# Altium project Common_AMC_Box.PrjPcb (part 5 of 6)

## Sheet USB_UART.SchDoc: Title
size 420 x 297 mm; Author: G.Kasprowicz; CompanyName: WUT ISE; DrawnBy: G.Kasprowicz; Organization: WUT ISE; Address1: PW ISE; Address2: Nowowiejska 15/19 00-665 Warsaw; Address3: gkasprow@gmail.com; DocumentNumber: 15; Revision: 2; SheetNumber: 15; SheetTotal: 18; ModifiedBy: -; CheckedDate: -; Title2: Title 2; DivGrp: WUT ISE; Designer: G.Kasprowicz; ModifiedDate: -; ProjectName: Sensor Box
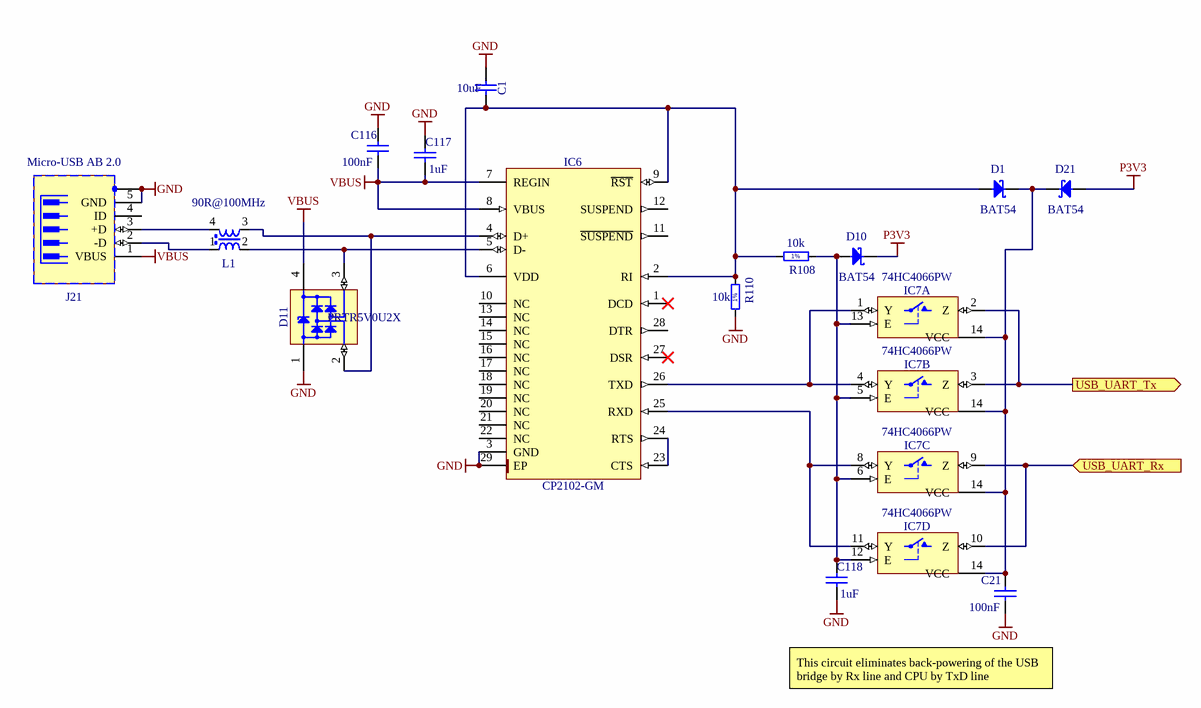
[diagram p13: USB_UART.SchDoc]

### Parts
C1  10uF  [CAPC2012X135N]
C21  100nF  [CAPC1005X55N]
C116  100nF  [CAPC1005X55N]
C117  1uF  [CAPC1005X55N]
C118  1uF  [CAPC1005X55N]
D1  BAT54  [SOT95P240X130-3N]
D10  BAT54  [SOT95P240X130-3N]
D11  PRTR5V0U2X  [SOT190P230X110-4N]
D21  BAT54  [SOT95P240X130-3N]
IC6  CP2102-GM  [QFN50P500X500X100-29N-S335]
IC7  74HC4066PW  [SOP65P640X110-14N]  (parts A,B,C,D of 4)
J21  Micro-USB AB 2.0  [HIROSE_ZX62RD-AB-5P8(30)]
L1  90R@100MHz  [IND_MURATA_DLW21S]
R108  10k  [RESC1005X40N]
R110  10k  [RESC1005X40N]

### Ports
USB_UART_Rx (in), USB_UART_Tx (out)

### Nets
GND: C1.1 C21.1 C116.2 C117.1 C118.2 D11.1(GND) IC6.3(GND) IC6.29(EP) IC7.7(GND) J21.5(GND) J21.6(SH) R110.1
P3V3: D10.3(C) D21.1(A)
VBUS: C116.1 C117.2 D11.4(VCC) IC6.7(REGIN) IC6.8(VBUS) J21.1(VBUS)
NetC1_2: C1.2 D1.1(A) IC6.2(RI) IC6.6(VDD) IC6.9(~{RST}) R108.1 R110.2
NetC21_2: C21.2 D1.3(C) D21.3(C) IC7.14(VCC)
NetC118_1: C118.1 D10.1(A) IC7.5(E) IC7.6(E) IC7.12(E) IC7.13(E) R108.2
NetD11_2: D11.2(I/O1) IC6.4(D+) L1.3
NetD11_3: D11.3(I/O2) IC6.5(D-) L1.2
NetIC6_23: IC6.23(CTS) IC6.24(RTS)
NetIC6_25: IC6.25(RXD) IC7.8(Y) IC7.11(Y)
NetIC6_26: IC6.26(TXD) IC7.1(Y) IC7.4(Y)
NetIC7_2: IC7.2(Z) IC7.3(Z) ; port USB_UART_Tx
NetIC7_9: IC7.9(Z) IC7.10(Z) ; port USB_UART_Rx
NetJ21_2: J21.2(-D) L1.1
NetJ21_3: J21.3(+D) L1.4

Not connected (* = marked no-connect by the designer): IC6 1(DCD)* 10(NC) 11(~{SUSPEND}) 12(SUSPEND) 13(NC) 14(NC) 15(NC) 16(NC) 17(NC) 18(NC) 19(NC) 20(NC) 21(NC) 22(NC) 27(DSR)* 28(DTR); J21 4(ID)

### Notes on the sheet
- This circuit eliminates back-powering of the USB bridge by Rx line and CPU by TxD line
- Project/Equipment
- Document
- Designer
- Drawn by
- Check.by
- Copyright WUT ISE 2020.
  This documentation describes Open Hardware and is licensed under the CERN OHL v.1.2. You may redistribute and modify this documentation under the terms of the CERN OHL v.1.2. (http://ohwr.org/CERNOHL). This documentation is distributed WITHOUT ANY EXPRESS OR IMPLIED WARRANTY, INCLUDING OF MERCHANTABILITY, SATISFACTORY QUALITY AND FITNESS FOR A PARTICULAR PURPOSE. Please see the CERN OHL v.1.2 for applicable conditions.
- Contact
- File
- Last Mod.
- Print Date
- Sheet
- Size
- A3
- of
- Rev
- (in symbol R0402_10K_1%_0.0625W_100PPM) 1%

### Library data of the parts
C1 = CC0805_10UF_16V_10%_X5R: Non-polarised capacitor; Part Description: SMD Multilayer Chip Ceramic Capacitor; Manufacturer: GENERIC; Manufacturer1 Part Number: C0805C106K4PAC; Voltage: 16V; TC: X5R; Tolerance: ±10%; Part Number: CC0805_10UF_16V_10%_X5R; Component Kind: Standard; Component Type: Standard; Pin Count: 2; Value: 10uF; Status: Preferred; Manufacturer Part Number: CC0805_10UF_16V_10%_X5R; Case: 0805; Mounted: Yes; Socket: No; SMD: Yes; Manufacturer1 Example: KEMET; Manufacturer1 ComponentHeight: 1.4mm; HelpURL: \\cern.ch\dfs\Applications\Altium\Datasheets\CC1206_X5R_KEMET.pdf; Author: CERN DEM JLC; CreateDate: 03.12.2007; LatestRevisionDate: 03.12.2007; Sense: No
C21 C116 = CC0402_100NF_16V_10%_X5R: as C113 on sheet Thermal_MGT; Part Number: CC0402_100NF_16V_10%_X5R; Component Kind: Standard; Component Type: Standard; Pin Count: 2; Value: 100nF; Status: None; Manufacturer Part Number: CC0402_100NF_16V_10%_X5R; Case: 0402; Mounted: Yes; Socket: No; SMD: Yes; Manufacturer1 Example: MURATA; Manufacturer1 ComponentHeight: 0.55mm; HelpURL: \\cern.ch\dfs\Applications\Altium\Datasheets\CC0402_X5R_MURATA_GRM.pdf; Author: CERN DEM JLC; CreateDate: 10.12.2013; LatestRevisionDate: 10.12.2013; Sense: No
C117 C118 = CC0402_1UF_16V_10%_X5R: as C55 on sheet USB_Hub_AMCbox; Part Number: CC0402_1UF_16V_10%_X5R; Component Kind: Standard; Component Type: Standard; Pin Count: 2; Value: 1uF; Status: Preferred; Manufacturer Part Number: CC0402_1UF_16V_10%_X5R; Case: 0402; Mounted: Yes; Socket: No; SMD: Yes; Sense: No; Manufacturer1 Example: TDK; Manufacturer1 ComponentHeight: 0.55mm; HelpURL: \\cern.ch\dfs\Applications\Altium\Datasheets\CC0402_X5R_TDK_C.pdf; Author: CERN DEM JLC; CreateDate: 25.10.2012; LatestRevisionDate: 25.10.2012
D1 D10 D21 = BAT54: as D5 on sheet CPU_ETH; Part Number: BAT54; Component Kind: Standard; Component Type: Standard; Device: BAT54; PackageDescription: SOT23 3-Leads, Pitch 0.95mm - Body 1.3x2.9mm, IPC Medium Density; Manufacturer Part Number: BAT54; Pin Count: 3; Case: SOT23-3; Mounted: Yes; Socket: No; SMD: Yes; ComponentHeight: 1.30mm; HelpURL: \\cern.ch\dfs\Applications\Altium\Datasheets\BAT54.pdf; Author: CERN DEM JLC; CreateDate: 2009-09-17; LatestRevisionDate: 2010-05-27
D11 = PRTR5V0U2X: Ultra Low Capacitance Double Rail-to-Rail ESD Protection Diode; Part Description: Ultra Low Capacitance (1pF) Double Rail-to-Rail ESD Protection Diode (8kV); Manufacturer: NXP SEMICONDUCTORS; Voltage: 5.5V; PressFit: No; Bonding: No; Table: Diodes; Part Number: PRTR5V0U2X; Component Kind: Standard; Component Type: Standard; Device: PRTR5V0U2X; PackageDescription: SOT143B, SOT, 1.90mm Pitch; 4 Pin, 1.30mm W X 2.90mm L X 1.10mm H body, IPC Medium Density; Manufacturer Part Number: PRTR5V0U2X; Pin Count: 4; Case: SOT143B; Mounted: Yes; Socket: No; SMD: Yes; ComponentHeight: 1.1mm; HelpURL: \\cern.ch\dfs\Applications\Altium\Datasheets\PRTR5V0U2X.pdf; Author: CERN DEM JLC; CreateDate: 2011-03-22; LatestRevisionDate: 2011-03-22
IC6 = CP2102-GM: Single-Chip USB to UART Bridge; Manufacturer: SILICON LABS; Table: Analog & Interface; Part Number: CP2102-GM; Component Kind: Standard; Component Type: Standard; Device: CP2102-GM; PackageDescription: QFN, 0.50mm Pitch, Square; 28 pin, 5.00mm L X 5.00mm W X 1.00mm H body (w/thermal tab 3.35 X 3.35mm),  IPC Medium Density; Part Description: Single-Chip USB to UART Bridge; Manufacturer Part Number: CP2102-GM; Pin Count: 29; Case: QFN28; Mounted: Yes; Socket: No; SMD: Yes; ComponentHeight: 1.0mm; Author: CERN DEM JLC; HelpURL: \\cern.ch\dfs\Applications\Altium\Datasheets\CP2102-GM.pdf; CreateDate: 2011-03-03; LatestRevisionDate: 2011-03-03
IC7 = 74HC4066PW: Part Description: Quad Single-Pole Single-Throw Analog Switch; Manufacturer: NXP SEMICONDUCTORS; PressFit: No; Bonding: No; Part Number: 74HC4066PW; Component Kind: Standard; Component Type: Standard; Device: 74HC4066PW; PackageDescription: SOP, 0.65mm Pitch; 14 Pin, 4.40mm W X 5.00mm L X 1.20mm H body, IPC Medium Density; Manufacturer Part Number: 74HC4066PW; Pin Count: 14; Case: TSSOP14; Mounted: Yes; Socket: No; SMD: Yes; Sense: No; ComponentHeight: 1.1mm; Author: CERN DEM JLC; HelpURL: \\cern.ch\dfs\Applications\Altium\Datasheets\74HC4066PW.pdf; CreateDate: 19.11.2014; LatestRevisionDate: 19.11.2014
J21 = HIROSE_ZX62RD-AB-5P8(30): 5 Pin + 1 Shield USB Receptacle; Part Description: Micro-USB 2.0 Right Angle, SMD Type AB - Reverse (Top mount), Shell Through Hole; Manufacturer: HIROSE (HRS); PressFit: No; Part Number: HIROSE_ZX62RD-AB-5P8(30); Component Kind: Standard; Component Type: Standard; Pin Count: 7; Family: Micro-USB AB 2.0; Mounted: Yes; Socket: No; SMD: Yes; Sense: No; Status: None; Manufacturer Part Number: ZX62RD-AB-5P8(30); ComponentHeight: 2.35mm; HelpURL: \\cern.ch\dfs\Applications\Altium\Datasheets\HIROSE_ZX62RD-AB-5P8(30).pdf; ComponentLink1URL: \\cern.ch\dfs\Applications\Altium\Datasheets\HIROSE_ZX62RD-AB-5P8(30)_Package-Drawing.pdf; ComponentLink1Description: Package-Drawing; Author: CERN DEM JMW; CreateDate: 22.06.2017; LatestRevisionDate: 22.06.2017
L1 = IND_MURATA_DLW21SN900SQ2L: Inductor Common Mode; Part Description: Wire Wound Common Mode Choke Coil (DLW21S Series); Manufacturer: MURATA; Power: 330mA; Resistance: 0.35R; Tolerance: ±25%; Table: Inductors SMD; Part Number: IND_MURATA_DLW21SN900SQ2L; Component Kind: Standard; Component Type: Standard; Pin Count: 4; Value: 90R@100MHz; Status: None; Manufacturer Part Number: DLW21SN900SQ2L; Case: 0805; Mounted: Yes; Socket: No; SMD: Yes; ComponentHeight: 1.4mm; HelpURL: \\cern.ch\dfs\Applications\Altium\Datasheets\IND_MURATA_DLW21S.pdf; Author: CERN DEM JLC; CreateDate: 2014-07-01; LatestRevisionDate: 2014-07-01
R108 R110 = R0402_10K_1%_0.0625W_100PPM: as R147-R150 on sheet Thermal_MGT; Part Number: R0402_10K_1%_0.0625W_100PPM; Component Kind: Standard; Component Type: Standard; Pin Count: 2; Value: 10k; Status: Not recommended; Power: 0.0625W; Tolerance: ±1%; Manufacturer Part Number: R0402_10K_1%_0.0625W_100PPM; Case: 0402; Mounted: Yes; Socket: No; SMD: Yes; Manufacturer1 Example: YAGEO PHYCOMP; Manufacturer1 ComponentHeight: 0.4mm; HelpURL: \\cern.ch\dfs\Applications\Altium\Datasheets\R0402_Phycomp_RC0402.pdf; Author: CERN DEM JLC; CreateDate: 2007-12-03; LatestRevisionDate: 2012-10-17

## Sheet JTAG_AMC_Box.SchDoc: JTAG
size 420 x 297 mm; Author: G.Kasprowicz; CompanyName: WUT ISE; DrawnBy: G.Kasprowicz; Organization: WUT ISE; Address1: PW ISE; Address2: Nowowiejska 15/19 00-665 Warsaw; Address3: gkasprow@gmail.com; DocumentNumber: 7; Revision: 2; SheetNumber: 7; SheetTotal: 18; ModifiedBy: -; CheckedDate: -; Title2: connectors & logics; DivGrp: WUT ISE; Designer: G.Kasprowicz; ModifiedDate: -; ProjectName: Sensor Box
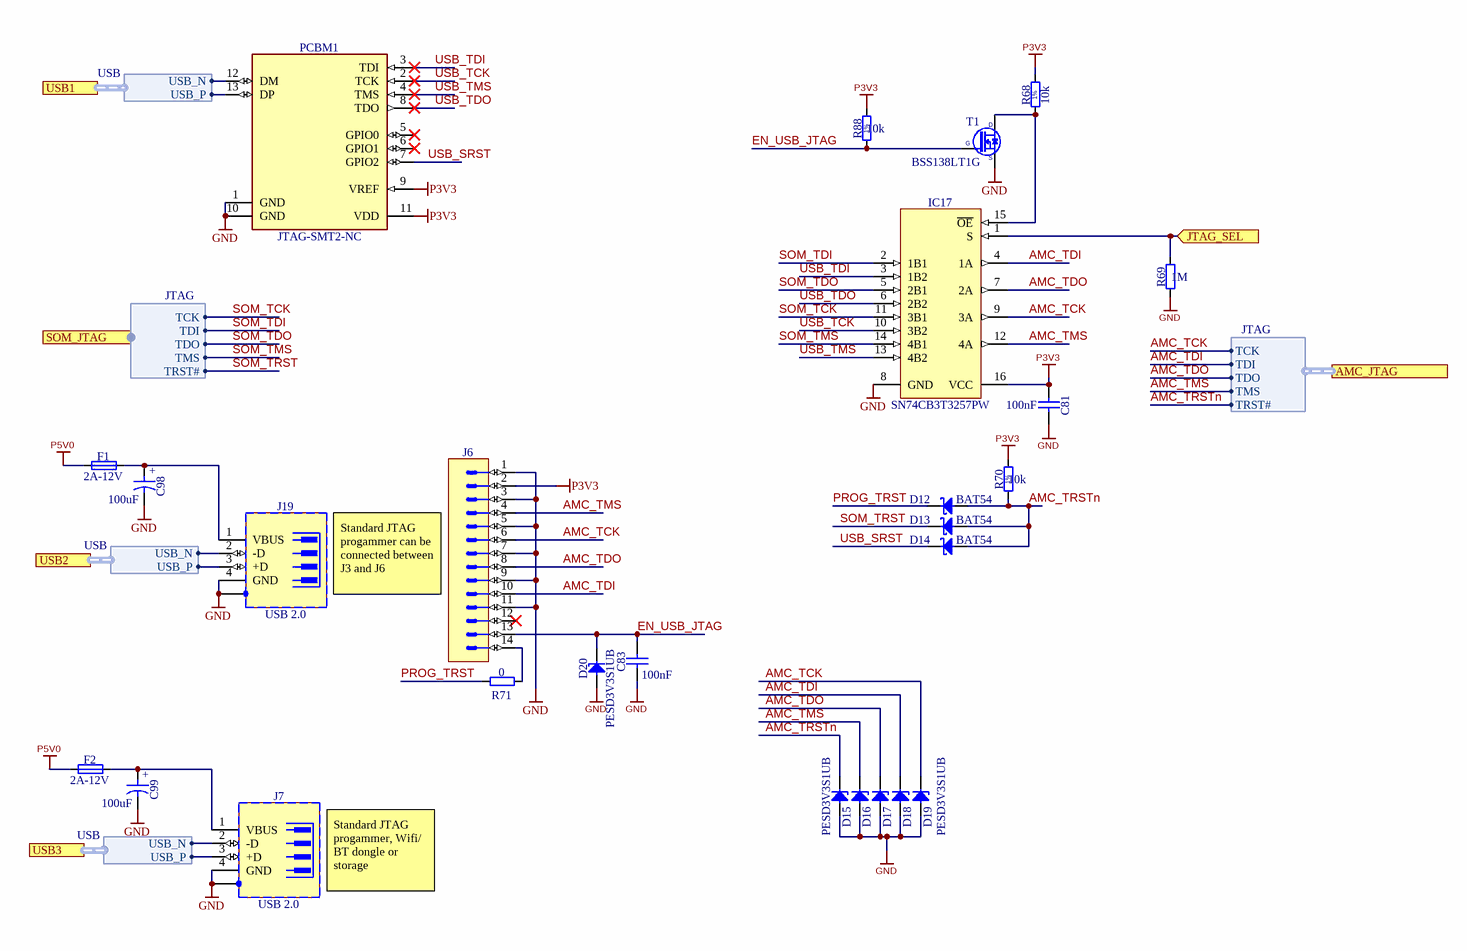
[diagram p14: JTAG_AMC_Box.SchDoc]

### Parts
C81  100nF  [CAPC0603X33N]
C83  100nF  [CAPC0603X33N]
C98  100uF  [CAPAE660X540N]
C99  100uF  [CAPAE660X540N]
D12  BAT54  [SOT95P240X130-3N]
D13  BAT54  [SOT95P240X130-3N]
D14  BAT54  [SOT95P240X130-3N]
D15  PESD3V3S1UB  [SODFL1608X65N]
D16  PESD3V3S1UB  [SODFL1608X65N]  (value not drawn)
D17  PESD3V3S1UB  [SODFL1608X65N]  (value not drawn)
D18  PESD3V3S1UB  [SODFL1608X65N]  (value not drawn)
D19  PESD3V3S1UB  [SODFL1608X65N]
D20  PESD3V3S1UB  [SODFL1608X65N]
F1  2A-12V  [FUSR_LITTELFUSE_1812L200]
F2  2A-12V  [FUSR_LITTELFUSE_1812L200]
IC17  SN74CB3T3257PW  [SOP65P640X120-16N]
J6  Milli-Grid™  [MOLEX_87832-1420]  (value not drawn)
J7  USB 2.0  [TYCO_1734366-1]
J19  USB 2.0  [TYCO_292303-1]
PCBM1  JTAG-SMT2-NC  [PCBM_DIGILENT_JTAG-SMT2-NC]
R68  10k  [RESC1005X40N]
R69  1M  [RESC1005X40N]
R70  10k  [RESC1005X40N]
R71  0  [RESC1005X40N]
R88  10k  [RESC1005X40N]
T1  BSS138LT1G  [SOT95P240X110-3N]

### Ports
AMC_JTAG (harness JTAG), JTAG_SEL (in), SOM_JTAG (harness JTAG), USB1 (harness USB), USB2 (harness USB), USB3 (harness USB)

### Harnesses
USB: USB_N, USB_P
JTAG: TCK, TMS, TDI, TDO, TRST#

### Nets
GND: C81.1 C83.1 C98.2 C99.2 D15.2(A) D16.2(A) D17.2(A) D18.2(A) D19.2(A) D20.2(A) IC17.8(GND) J6.1 J6.3 J6.5 J6.7 J6.9 J6.11 J7.4(GND) J7.5(SHIELD) J19.4(GND) J19.5(SHIELD) PCBM1.1(GND) PCBM1.10(GND) R69.1 T1.2(S)
P3V3: C81.2 IC17.16(VCC) J6.2 PCBM1.9(VREF) PCBM1.11(VDD) R68.2 R70.2 R88.2
P5V0: F1.1 F2.1
AMC_TCK: D19.1(C) IC17.9(3A) J6.6 ; port AMC_JTAG.TCK
AMC_TDI: D18.1(C) IC17.4(1A) J6.10 ; port AMC_JTAG.TDI
AMC_TDO: D17.1(C) IC17.7(2A) J6.8 ; port AMC_JTAG.TDO
AMC_TMS: D16.1(C) IC17.12(4A) J6.4 ; port AMC_JTAG.TMS
AMC_TRSTn: D12.1(A) D13.1(A) D14.1(A) D15.1(C) R70.1 ; port AMC_JTAG.TRST#
EN_USB_JTAG: C83.2 D20.1(C) J6.13 R88.1 T1.1(G)
PROG_TRST: D12.3(C) R71.2
SOM_TCK: IC17.11(3B1) ; port SOM_JTAG.TCK
SOM_TDI: IC17.2(1B1) ; port SOM_JTAG.TDI
SOM_TDO: IC17.5(2B1) ; port SOM_JTAG.TDO
SOM_TMS: IC17.14(4B1) ; port SOM_JTAG.TMS
SOM_TRST: D13.3(C) ; port SOM_JTAG.TRST#
USB1_N: PCBM1.12(DM) ; port USB1.USB_N
USB1_P: PCBM1.13(DP) ; port USB1.USB_P
USB2_N: J19.2(-D) ; port USB2.USB_N
USB2_P: J19.3(+D) ; port USB2.USB_P
USB3_N: J7.2(-D) ; port USB3.USB_N
USB3_P: J7.3(+D) ; port USB3.USB_P
USB_SRST: D14.3(C) PCBM1.7(GPIO2)
USB_TCK: IC17.10(3B2) PCBM1.2(TCK)
USB_TDI: IC17.3(1B2) PCBM1.3(TDI)
USB_TDO: IC17.6(2B2) PCBM1.8(TDO)
USB_TMS: IC17.13(4B2) PCBM1.4(TMS)
NetC98_1: C98.1 F1.2 J19.1(VBUS)
NetC99_1: C99.1 F2.2 J7.1(VBUS)
NetIC17_1: IC17.1(S) R69.2 ; port JTAG_SEL
NetIC17_15: IC17.15(~{OE}) R68.1 T1.3(D)
NetJ6_14: J6.14 R71.1

Not connected (* = marked no-connect by the designer): J6 12*; PCBM1 5(GPIO0)* 6(GPIO1)*

### Notes on the sheet
- (near J6) Standard JTAG progammer can be connected between J3 and J6
- Standard JTAG progammer, Wifi/ BT dongle or storage
- Project/Equipment
- Document
- Designer
- Drawn by
- Check.by
- Copyright WUT ISE 2020.
  This documentation describes Open Hardware and is licensed under the CERN OHL v.1.2. You may redistribute and modify this documentation under the terms of the CERN OHL v.1.2. (http://ohwr.org/CERNOHL). This documentation is distributed WITHOUT ANY EXPRESS OR IMPLIED WARRANTY, INCLUDING OF MERCHANTABILITY, SATISFACTORY QUALITY AND FITNESS FOR A PARTICULAR PURPOSE. Please see the CERN OHL v.1.2 for applicable conditions.
- Contact
- File
- Last Mod.
- Print Date
- Sheet
- Size
- A3
- of
- Rev
- (in symbol CAE660-540_100UF_16V_20%) +
- (in symbol R0402_10K_1%_0.0625W_100PPM) 1%

### Library data of the parts
C81 C83 = CC0201_100NF_6.3V_10%_X5R: Non-polarised capacitor; Manufacturer: GENERIC; Part Description: SMD Multilayer Chip Ceramic Capacitor; Manufacturer1 Part Number: 02016D104KAT2A; Tolerance: ±10%; Voltage: 6.3V; TC: X5R; Manufacturer Part Number: CC0201_100NF_6.3V_10%_X5R; Part Number: CC0201_100NF_6.3V_10%_X5R; Value: 100nF; Component Kind: Standard; Component Type: Standard; Pin Count: 2; Status: Not Recommended; Case: 0201; Mounted: Yes; Socket: No; SMD: Yes; Sense: No; Manufacturer1 Example: AVX; Manufacturer1 ComponentHeight: 0.33mm; HelpURL: \\cern.ch\dfs\Applications\Altium\Datasheets\CC0201_X5R_AVX.pdf; Author: CERN DEM JLC; CreateDate: 03.12.2007; LatestRevisionDate: 03.12.2007
C98 C99 = CAE660-540_100UF_16V_20%: Polarised capacitor; Part Description: Aluminum Electrolytic SMT Capacitor; Manufacturer: PANASONIC; Manufacturer Part Number: EEEFK1C101AP; Voltage: 16V; Tolerance: ±20%; Part Number: CAE660-540_100UF_16V_20%; Component Kind: Standard; Component Type: Standard; Pin Count: 2; Value: 100uF; Status: Not Recommended; Case: D; Mounted: Yes; Socket: No; SMD: Yes; Sense: No; ComponentHeight: 5.8mm; HelpURL: \\cern.ch\dfs\Applications\Altium\Datasheets\CAE_PANASONIC_FK.pdf; Author: CERN DEM JLC; CreateDate: 03.12.2007; LatestRevisionDate: 05.11.2014
D12-D14 = BAT54: as D5 on sheet CPU_ETH; Part Number: BAT54; Component Kind: Standard; Component Type: Standard; Device: BAT54; PackageDescription: SOT23 3-Leads, Pitch 0.95mm - Body 1.3x2.9mm, IPC Medium Density; Manufacturer Part Number: BAT54; Pin Count: 3; Case: SOT23-3; Mounted: Yes; Socket: No; SMD: Yes; ComponentHeight: 1.30mm; HelpURL: \\cern.ch\dfs\Applications\Altium\Datasheets\BAT54.pdf; Author: CERN DEM JLC; CreateDate: 2009-09-17; LatestRevisionDate: 2010-05-27
D15-D20 = PESD3V3S1UB: ESD protection diode; Manufacturer Part Number: ESD8351XV2T1G; Manufacturer: NXP SEMICONDUCTORS; Part Description: ESD protection diode (23kV); Voltage: 3V3; Power: 330W; PressFit: No; Bonding: No; PackageDescription: Ultra Small Outline Diode Flat Lead (SOD-523), Body; 1.2mm L X 0.8mm W X 0.65mm H, IPC Medium Density; Part Number: PESD3V3S1UB; Component Kind: Standard; Component Type: Standard; Device: PESD3V3S1UB; Pin Count: 2; Case: SOD523; Mounted: Yes; Socket: No; SMD: Yes; Sense: No; ComponentHeight: 0.65mm; HelpURL: \\cern.ch\dfs\Applications\Altium\Datasheets\PESD3V3S1UB.pdf; Author: CERN DEM JLC; CreateDate: 29.11.2012; LatestRevisionDate: 29.11.2012
F1 F2 = FUSR1812_LITTELFUSE_1812L200/12: Fuse; Part Description: POLYFUSE® Surface Mount Resettable PTC; Manufacturer Part Number: 1812L200/12DR; PressFit: No; Part Number: FUSR1812_LITTELFUSE_1812L200/12; Component Kind: Standard; Component Type: Standard; Pin Count: 2; PackageDescription: Surface Mount POLY-FUSE® Resettable PTC, Body 4.55x3.24mm, 1812L Series; Family: Fuses Resettable; Mounted: Yes; Socket: No; SMD: Yes; Sense: No; Value: 2A-12V; Manufacturer: LITTELFUSE; ComponentHeight: 1.2mm; HelpURL: \\cern.ch\dfs\Applications\Altium\Datasheets\FUSR_LITTELFUSE_1812L.pdf; Author: CERN DEM BC; CreateDate: 23.03.2021; LatestRevisionDate: 23.03.2021
IC17 = SN74CB3T3257PW: 4-BIT 1-OF-2 FET Multiplexer/Demultiplexer 2.5V/3.3V Low-Voltage Bus Switch 5V Tolerant Shifter; Manufacturer: TEXAS INSTRUMENTS; PressFit: No; Bonding: No; Manufacturer Part Number: SN74CB3T3257PW; PackageDescription: SOP, 0.65mm pitch; 16 pin, 4.40mm W X 5.00mm L X 1.20mm H body IPC Medium Density; Part Description: 4-Bit 1-of-2 FET Multiplexer/Demultiplexer 2.5V/3.3V Low-Voltage Bus Switch 5V Tolerant Shifter; Part Number: SN74CB3T3257PW; Component Kind: Standard; Component Type: Standard; Device: SN74CB3T3257PW; Pin Count: 16; Case: TSSOP16; Mounted: Yes; Socket: No; SMD: Yes; Sense: No; ComponentHeight: 1.2mm; Author: CERN DEM JLC; HelpURL: \\cern.ch\dfs\Applications\Altium\Datasheets\SN74CB3T3257PW.pdf; CreateDate: 30.01.2012; LatestRevisionDate: 30.01.2012
J6 = MOLEX_87832-1420: Connector 14 Male; Part Description: 2.00mm (.079") Pitch Milli-Grid™ Header, Surface Mount, Vertical, Shrouded, 14 Circuits,with Locking Windows and Centre Polarization Slot, PCB Locator; Manufacturer: MOLEX; Part Number: MOLEX_87832-1420; Component Kind: Standard; Component Type: Standard; Pin Count: 14; Family: Milli-Grid™; Mounted: Yes; Socket: No; SMD: Yes; Status: None; Manufacturer Part Number: 87832-1420; ComponentHeight: 6.4mm; HelpURL: \\cern.ch\dfs\Applications\Altium\Datasheets\MOLEX_87832-1420.pdf; Author: CERN DEM JLC; CreateDate: 2008-09-09; LatestRevisionDate: 2008-09-09; Table: MOLEX
J7 = TYCO_1734366-1: 4 Pin + 1 Shield USB Receptacle; Part Description: 4 Position, Straight, USB 2.0 Type A Receptacle; Manufacturer: TYCO ELECTRONICS; PressFit: No; Part Number: TYCO_1734366-1; Component Kind: Standard; Component Type: Standard; Pin Count: 6; Family: USB 2.0; Mounted: Yes; Socket: No; SMD: No; Sense: No; Status: None; Manufacturer Part Number: 1734366-1; ComponentHeight: 15mm; HelpURL: \\cern.ch\dfs\Applications\Altium\Datasheets\TYCO_1734366-1.pdf; Author: CERN DEM MR; CreateDate: 30.05.2016; LatestRevisionDate: 30.05.2016
J19 = TYCO_292303-1: 4 Pin + 1 Shield USB Receptacle; Part Description: 4 Positions, Right Angle, USB 2.0 Type A Receptacle; Manufacturer: TYCO ELECTRONICS; PressFit: No; Part Number: TYCO_292303-1; Component Kind: Standard; Component Type: Standard; Pin Count: 5; Family: USB 2.0; Mounted: Yes; Socket: No; SMD: No; Sense: No; Status: None; Manufacturer Part Number: 292303-1; ComponentHeight: 7.65mm; HelpURL: \\cern.ch\dfs\Applications\Altium\Datasheets\TYCO_292303-1.pdf; Author: CERN DEM JMW; CreateDate: 13.08.2015; LatestRevisionDate: 13.08.2015
PCBM1 = PCBM_DIGILENT_JTAG-SMT2-NC: Programming Module for Xilinx FPGAs; Part Description: Programming Module for Xilinx® FPGAs; PressFit: No; Bonding: No; Part Number: PCBM_DIGILENT_JTAG-SMT2; Component Kind: Standard; Component Type: Standard; Device: JTAG-SMT2-NC; PackageDescription: JTAG-SMT2 Case, 5.00mm Pitch; 11 Pins, 22.75mm W X 21.5mm L X 3.00mm H body; Manufacturer: DIGILENT; Manufacturer Part Number: JTAG-SMT2-NC; Pin Count: 11; Mounted: Yes; Socket: No; SMD: Yes; Sense: No; ComponentHeight: 12.55mm; Author: GK; HelpURL: \\cern.ch\dfs\Applications\Altium\Datasheets\PCBM_DIGILENT_JTAG-SMT2.pdf; CreateDate: 27.05.2021; LatestRevisionDate: 27.05.2021
R68 R70 R88 = R0402_10K_1%_0.0625W_100PPM: Resistor - 1%; Manufacturer: GENERIC; Part Description: General Purpose Thick Film Chip Resistor; Manufacturer1 Part Number: 232270671003L; TC: ±100ppm/°C; PressFit: No; Manufacturer Part Number: R0402_10K_1%_0.0625W_100PPM; Part Number: R0402_10K_1%_0.0625W_100PPM; Tolerance: ±1%; Value: 10k; Component Kind: Standard; Component Type: Standard; Pin Count: 2; Status: Not Recommended; Power: 0.0625W; Case: 0402; Mounted: Yes; Sense: No; Socket: No; SMD: Yes; Manufacturer1 Example: YAGEO PHYCOMP; Manufacturer1 ComponentHeight: 0.4mm; HelpURL: \\cern.ch\dfs\Applications\Altium\Datasheets\R0402_Phycomp_RC0402.pdf; Author: CERN DEM JLC; CreateDate: 03.12.2007; LatestRevisionDate: 17.10.2012
R69 = R0402_1M_1%_0.0625W_100PPM: Resistor - 1%; Manufacturer: GENERIC; Part Description: General Purpose Thick Film Chip Resistor; Manufacturer1 Part Number: 232270671005L; TC: ±100ppm/°C; PressFit: No; Manufacturer Part Number: R0402_1M_1%_0.0625W_100PPM; Part Number: R0402_1M_1%_0.0625W_100PPM; Tolerance: ±1%; Value: 1M; Component Kind: Standard; Component Type: Standard; Pin Count: 2; Status: Not Recommended; Power: 0.0625W; Case: 0402; Mounted: Yes; Sense: No; Socket: No; SMD: Yes; Manufacturer1 Example: YAGEO PHYCOMP; Manufacturer1 ComponentHeight: 0.4mm; HelpURL: \\cern.ch\dfs\Applications\Altium\Datasheets\R0402_Phycomp_RC0402.pdf; Author: CERN DEM JLC; CreateDate: 03.12.2007; LatestRevisionDate: 17.10.2012
R71 = R0402_0R_JUMPER: Resistor; Manufacturer: GENERIC; Part Description: 1A (0.05R Max DC Resistance) Zero Ohm Jumper; Manufacturer1 Part Number: 232270591001L; PressFit: No; Manufacturer Part Number: R0402_0R_JUMPER; Part Number: R0402_0R_JUMPER; Value: 0; Component Kind: Standard; Component Type: Standard; Pin Count: 2; Status: Not Recommended; Case: 0402; Mounted: Yes; Sense: No; Socket: No; SMD: Yes; Manufacturer1 Example: YAGEO PHYCOMP; Manufacturer1 ComponentHeight: 0.4mm; HelpURL: \\cern.ch\dfs\Applications\Altium\Datasheets\R0402_Phycomp_RC0402.pdf; Author: CERN DEM JLC; CreateDate: 03.12.2007; LatestRevisionDate: 17.10.2012
T1 = BSS138LT1G: N-CHANNEL MOSFET WITH DIODE; Manufacturer: ON SEMICONDUCTOR; Part Description: 50V 200mA N-Channel Enhancement Mode Field-Effect Transistor; PressFit: No; Bonding: No; Manufacturer Part Number: BSS138LT1G; PackageDescription: SOT23 3-Leads, Pitch 0.95mm - Body 1.4x3mm, IPC Medium Density; Part Number: BSS138LT1G; Component Kind: Standard; Component Type: Standard; Device: BSS138LT1G; Pin Count: 3; Case: SOT23-3; Mounted: Yes; Socket: No; SMD: Yes; Sense: No; ComponentHeight: 1.11mm; HelpURL: \\cern.ch\dfs\Applications\Altium\Datasheets\BSS138LT1G.pdf; Author: CERN DEM JLC; CreateDate: 23.03.2009; LatestRevisionDate: 23.03.2009

## Sheet USB_I2C_Bridge.SchDoc: USB to I2C
size 420 x 297 mm; Author: G.Kasprowicz; CompanyName: WUT ISE; DrawnBy: G.Kasprowicz; Organization: WUT ISE; Address1: PW ISE; Address2: Nowowiejska 15/19 00-665 Warsaw; Address3: gkasprow@gmail.com; DocumentNumber: 14; Revision: 2; SheetNumber: 14; SheetTotal: 18; ModifiedBy: -; CheckedDate: -; Title2: Converter; DivGrp: WUT ISE; Designer: G.Kasprowicz; ModifiedDate: -; ProjectName: Sensor Box
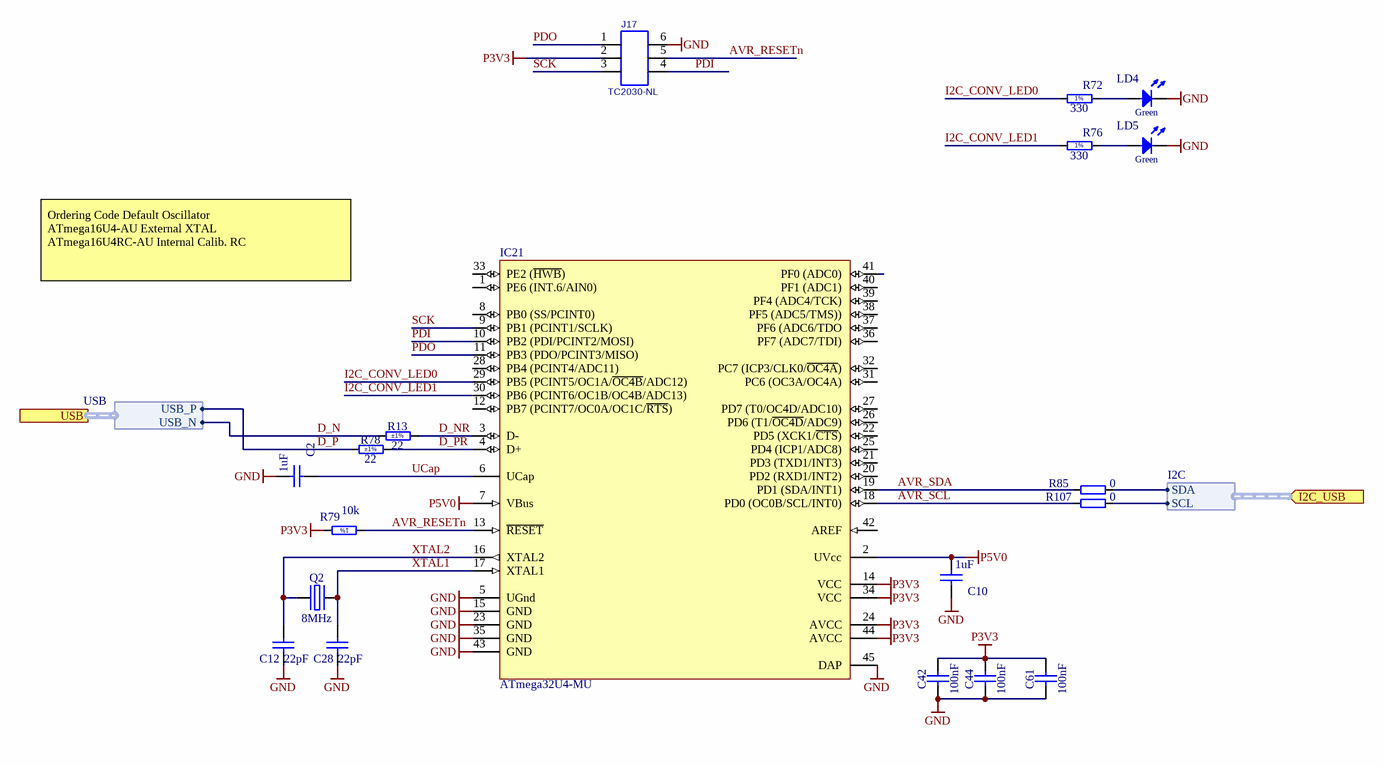
[diagram p15: USB_I2C_Bridge.SchDoc]

### Parts
(Parts that share a designator on the sheet are numbered #1, #2 ... from top to bottom, then left to right.)
C2#1  1uF  [CAPC1608X87N]
C10  1uF  [CAPC1608X87N]
C12  22pF  [CAPC1005X55N]
C28  22pF  [CAPC1005X55N]
C42  100nF  [CAPC1005X55N]
C44  100nF  [CAPC1005X55N]
C61  100nF  [CAPC1005X55N]
IC21  ATmega32U4-MU  [44PW_M]
J17#1  TC2030-NL  [TC2030-NL]  (no BOM)
LD4  LED_AVAGO_HSME-C120  [LED_AVAGO_HSME-C120]  (value not drawn)
LD5  LED_AVAGO_HSME-C120  [LED_AVAGO_HSME-C120]  (value not drawn)
Q2  8MHz  [XTAL_TXC_7A]
R13  22  Tolerance: ±1%  [RESC1005X40N]
R72  330  [RESC1608X55N]
R76  330  [RESC1608X55N]
R78  22  Tolerance: ±1%  [RESC1005X40N]
R79  10k  [RESC1005X40N]
R85  0  [RESC1005X40N]
R107  0  [RESC1005X40N]

### Ports
I2C_USB (in, harness I2C), USB (harness USB)

### Harnesses
USB: USB_N, USB_P
I2C: SCL, SDA

### Nets
GND: C2#1.2 C10.1 C12.1 C28.1 C42.1 C44.1 C61.1 IC21.5(UGnd) IC21.15(GND) IC21.23(GND) IC21.35(GND) IC21.43(GND) IC21.45(DAP) J17#1.6 LD4.1(C) LD5.1(C)
P3V3: C42.2 C44.2 C61.2 IC21.14(VCC) IC21.24(AVCC) IC21.34(VCC) IC21.44(AVCC) J17#1.2 R79.2
P5V0: C10.2 IC21.2(UVcc) IC21.7(VBus)
AVR_RESETn: IC21.13(~{RESET}) J17#1.5 R79.1
AVR_SCL: IC21.18(PD0_(OC0B/SCL/INT0)) R107.1
AVR_SDA: IC21.19(PD1_(SDA/INT1)) R85.1
D_N: R13.1 ; port USB.USB_N
D_NR: IC21.3(D-) R13.2
D_P: R78.1 ; port USB.USB_P
D_PR: IC21.4(D+) R78.2
I2C_CONV_LED0: IC21.29(PB5_(PCINT5/OC1A/~{OC4B}/ADC12)) R72.1
I2C_CONV_LED1: IC21.30(PB6_(PCINT6/OC1B/OC4B/ADC13)) R76.1
PDI: IC21.10(PB2_(PDI/PCINT2/MOSI)) J17#1.4
PDO: IC21.11(PB3_(PDO/PCINT3/MISO)) J17#1.1
SCK: IC21.9(PB1_(PCINT1/SCLK)) J17#1.3
UCap: C2#1.1 IC21.6(UCap)
XTAL1: C28.2 IC21.17(XTAL1) Q2.2(OSC2)
XTAL2: C12.2 IC21.16(XTAL2) Q2.1(OSC1)
NetLD4_2: LD4.2(A) R72.2
NetLD5_2: LD5.2(A) R76.2
NetR85_2: R85.2 ; port I2C_USB.SDA
NetR107_2: R107.2 ; port I2C_USB.SCL

Not connected (* = marked no-connect by the designer): IC21 1(PE6_(INT.6/AIN0)) 8(PB0_(SS/PCINT0)) 12(PB7_(PCINT7/OC0A/OC1C/~{RTS})) 20(PD2_(RXD1/INT2)) 21(PD3_(TXD1/INT3)) 22(PD5_(XCK1/~{CTS})) 25(PD4_(ICP1/ADC8)) 26(PD6_(T1/~{OC4D}/ADC9)) 27(PD7_(T0/OC4D/ADC10)) 28(PB4_(PCINT4/ADC11)) 31(PC6_(OC3A/OC4A)) 32(PC7_(ICP3/CLK0/~{OC4A})) 33(PE2_(~{HWB})) 36(PF7_(ADC7/TDI)) 37(PF6_(ADC6/TDO) 38(PF5_(ADC5/TMS))) 39(PF4_(ADC4/TCK)) 40(PF1_(ADC1)) 41(PF0_(ADC0)) 42(AREF)

### Notes on the sheet
- Ordering Code Default Oscillator
  ATmega16U4-AU External XTAL
  ATmega16U4RC-AU Internal Calib. RC
- Project/Equipment
- Document
- Designer
- Drawn by
- Check.by
- Copyright WUT ISE 2020.
  This documentation describes Open Hardware and is licensed under the CERN OHL v.1.2. You may redistribute and modify this documentation under the terms of the CERN OHL v.1.2. (http://ohwr.org/CERNOHL). This documentation is distributed WITHOUT ANY EXPRESS OR IMPLIED WARRANTY, INCLUDING OF MERCHANTABILITY, SATISFACTORY QUALITY AND FITNESS FOR A PARTICULAR PURPOSE. Please see the CERN OHL v.1.2 for applicable conditions.
- Contact
- File
- Last Mod.
- Print Date
- Sheet
- Size
- A3
- of
- Rev
- (in symbol R0402_10K_1%_0.0625W_100PPM) 1%
- (in symbol R0603_330R_1%_0.1W_100PPM) 1%

### Library data of the parts
C2#1 C10 = CC0603_1UF_25V_10%_X7R: Non-polarised capacitor; Part Description: SMD Multilayer Chip Ceramic Capacitor; Manufacturer: GENERIC; Manufacturer1 Part Number: GRM188R71E105KA12D; Voltage: 25V; TC: X7R; Tolerance: ±10%; Table: Capacitors SMD; Part Number: CC0603_1UF_25V_10%_X7R; Component Kind: Standard; Component Type: Standard; Pin Count: 2; Value: 1uF; Status: None; Manufacturer Part Number: CC0603_1UF_25V_10%_X7R; Case: 0603; Mounted: Yes; Socket: No; SMD: Yes; Manufacturer1 Example: MURATA; Manufacturer1 ComponentHeight: 0.9mm; HelpURL: \\cern.ch\dfs\Applications\Altium\Datasheets\CC0603_X7R_MURATA.pdf; Author: CERN DEM JLC; CreateDate: 2011-01-18; LatestRevisionDate: 2011-01-18
C12 C28 = CC0402_22PF_50V_5%_C0G: as C26 on sheet USB_Hub_AMCbox; Part Number: CC0402_22PF_50V_5%_C0G; Component Kind: Standard; Component Type: Standard; Pin Count: 2; Value: 22pF; Status: Preferred; Manufacturer Part Number: CC0402_22PF_50V_5%_C0G; Case: 0402; Mounted: Yes; Socket: No; SMD: Yes; Sense: No; Manufacturer1 Example: KEMET; Manufacturer1 ComponentHeight: 0.55mm; HelpURL: \\cern.ch\dfs\Applications\Altium\Datasheets\CC0402_C0G_KEMET_(Commercial Grade).pdf; Author: CERN DEM JLC; CreateDate: 03/12/2007; LatestRevisionDate: 03/12/2007
C42 C44 C61 = CC0402_100NF_16V_10%_X5R: Non-polarised capacitor; Part Description: SMD Multilayer Chip Ceramic Capacitor; Manufacturer: GENERIC; Manufacturer1 Part Number: GRM155R61C104KA88D; Voltage: 16V; TC: X5R; Tolerance: ±10%; Table: Capacitors SMD; Part Number: CC0402_100NF_16V_10%_X5R; Component Kind: Standard; Component Type: Standard; Pin Count: 2; Value: 100nF; Status: None; Manufacturer Part Number: CC0402_100NF_16V_10%_X5R; Case: 0402; Mounted: Yes; Socket: No; SMD: Yes; Manufacturer1 Example: MURATA; Manufacturer1 ComponentHeight: 0.55mm; HelpURL: \\cern.ch\dfs\Applications\Altium\Datasheets\CC0402_X5R_MURATA_GRM.pdf; Author: CERN DEM JLC; CreateDate: 2013-12-10; LatestRevisionDate: 2013-12-10
IC21 = CMP-0095-00166-2: 8-bit AVR Microcontroller, 2.7-5.5V, 16MHz, 32KB Flash, 1KB EEPROM, 2.5KB SRAM, USB Controller, 44-pin QFN, Industrial Grade (-40°C to 85°C), Ext Osc; PackageVersion: revG, Sep-2009; PackageReference: 44PW; ComponentLink1URL: http://www.atmel.com/; PackageDescription: 44-Pin Quad Flat No-Lead Package, 7 x 7 mm Body, 0.5 mm Pitch (QFN); ComponentLink3Description: ATmega16U4 ATmega32U4 Summary; RevisionNote: DatasheetVersion, PackageVersion & PCB updated. URLs added.; ComponentLink2Description: ATmega16U4/32U4 Datasheet; ComponentLink1Description: Manufacturer URL; ComponentLink3URL: http://www.atmel.com/dyn/resources/prod_documents/7766S.pdf; DatasheetVersion: revF, Nov-2010; ComponentLink2URL: http://www.atmel.com/dyn/resources/prod_documents/doc7766.pdf; Code_JEDEC: MO-220-VKKD-1
J17#1 = HDR 6 TC2030-NL: HDR, TC2030, 6 Pin, Footprint only; Mfg-1: Tag-Connect; Mfg-1-P/N: TC2030-IDC-NL; Value: TC2030-NL
LD4 LD5 = LED_AVAGO_HSME-C120: as LD2 on sheet CPU_ETH; Part Number: LED_AVAGO_HSME-C120; Component Kind: Standard; Component Type: Standard; Color: Green; PackageDescription: Green Chip LED, 2-Leads, Body 1.7x1.1mm, Side Emitting Package; Manufacturer Part Number: HSME-C120; Pin Count: 2; Mounted: Yes; Socket: No; SMD: Yes; ComponentHeight: 0.7mm; HelpURL: \\cern.ch\dfs\Applications\Altium\Datasheets\LED_AVAGO_HSME-C120.pdf; ComponentLink1URL: \\cern.ch\dfs\Applications\Altium\Datasheets\LED_AVAGO_HSME-C110_DESIGN-GUIDE.pdf; ComponentLink1Description: Design Guide; Author: CERN DEM JMW; CreateDate: 2009-07-22; LatestRevisionDate: 2012-06-20
Q2 = XTAL_8MHZ_TXC_7A-8.000MAAE-T: Quartz Crystal; Part Description: Tolerance: ±30ppm, Stability: ±30ppm, -20°C to +70°C, 12pF, SMD Glass Seam Sealing Crystal, 7A Series; Manufacturer: TXC CORPORATION; PressFit: No; Bonding: No; Part Number: XTAL_8MHZ_TXC_7A-8.000MAAE-T; Component Kind: Standard; Component Type: Standard; PackageDescription: 2 Pins, 3.2x5mm, SMD Glass Seam Sealing Crystal, 7A Serie; Value: 8MHz; Manufacturer Part Number: 7A-8.000MAAE-T; Pin Count: 2; Mounted: Yes; Socket: No; SMD: Yes; Sense: No; ComponentHeight: 1.2mm; HelpURL: \\cern.ch\dfs\Applications\Altium\Datasheets\XTAL_TXC_7A.pdf; Author: CERN DEM JLC; CreateDate: 09.10.2014; LatestRevisionDate: 12.11.2014
R13 R78 = R0402_22R_1%_0.0625W_100PPM: Resistor - 1%; Part Description: General Purpose Thick Film Chip Resistor; Manufacturer: GENERIC; Manufacturer1 Part Number: 232270672209L; TC: ±100ppm/°C; PressFit: No; Part Number: R0402_22R_1%_0.0625W_100PPM; Component Kind: Standard; Component Type: Standard; Pin Count: 2; Value: 22; Status: Not Recommended; Power: 0.0625W; Manufacturer Part Number: R0402_22R_1%_0.0625W_100PPM; Case: 0402; Mounted: Yes; Sense: No; Socket: No; SMD: Yes; Manufacturer1 Example: YAGEO PHYCOMP; Manufacturer1 ComponentHeight: 0.4mm; HelpURL: \\cern.ch\dfs\Applications\Altium\Datasheets\R0402_Phycomp_RC0402.pdf; Author: CERN DEM JLC; CreateDate: 03.12.2007; LatestRevisionDate: 17.10.2012
R72 R76 = R0603_330R_1%_0.1W_100PPM: as R56 on sheet CPU_ETH; Part Number: R0603_330R_1%_0.1W_100PPM; Component Kind: Standard; Component Type: Standard; Pin Count: 2; Value: 330; Status: Preferred; Tolerance: ±1%; Manufacturer Part Number: R0603_330R_1%_0.1W_100PPM; Case: 0603; Mounted: Yes; Socket: No; SMD: Yes; Manufacturer1 Example: NIC COMPONENT; Manufacturer1 ComponentHeight: 0.55mm; HelpURL: \\cern.ch\dfs\Applications\Altium\Datasheets\R0603_NIC_NRC.pdf; Author: CERN DEM JLC; CreateDate: 2007-12-03; LatestRevisionDate: 2008-03-13
R79 = R0402_10K_1%_0.0625W_100PPM: as R147-R150 on sheet Thermal_MGT; Part Number: R0402_10K_1%_0.0625W_100PPM; Component Kind: Standard; Component Type: Standard; Pin Count: 2; Value: 10k; Status: Not recommended; Power: 0.0625W; Tolerance: ±1%; Manufacturer Part Number: R0402_10K_1%_0.0625W_100PPM; Case: 0402; Mounted: Yes; Socket: No; SMD: Yes; Manufacturer1 Example: YAGEO PHYCOMP; Manufacturer1 ComponentHeight: 0.4mm; HelpURL: \\cern.ch\dfs\Applications\Altium\Datasheets\R0402_Phycomp_RC0402.pdf; Author: CERN DEM JLC; CreateDate: 2007-12-03; LatestRevisionDate: 2012-10-17
R85 R107 = R0402_0R_JUMPER: as R1#2 on sheet CPU_ETH; Part Number: R0402_0R_JUMPER; Component Kind: Standard; Component Type: Standard; Pin Count: 2; Value: 0; Status: Not Recommended; Manufacturer Part Number: R0402_0R_JUMPER; Case: 0402; Mounted: Yes; Socket: No; SMD: Yes; Manufacturer1 Example: YAGEO PHYCOMP; Manufacturer1 ComponentHeight: 0.4mm; HelpURL: \\cern.ch\dfs\Applications\Altium\Datasheets\R0402_Phycomp_RC0402.pdf; Author: CERN DEM JLC; CreateDate: 03.12.2007; LatestRevisionDate: 17.10.2012; Sense: No

## Sheet QSFP.SchDoc: QSFP connector
size 420 x 297 mm; EDA_Number: ARTIQ; Projet: RTM 4SFP 3QSFP; Author: G.Kasprowicz; CompanyName: WUT ISE; DrawnBy: G.Kasprowicz; Organization: WUT ISE; Address1: PW ISE; Address2: Nowowiejska 15/19 00-665 Warsaw; Address3: gkasprow@gmail.com; DocumentNumber: 9; Revision: 2; SheetNumber: 9; SheetTotal: 18; ModifiedBy: -; CheckedDate: -; Title2: Title 2; DivGrp: WUT ISE; Designer: G.Kasprowicz; ModifiedDate: -; ProjectName: Sensor Box
Used 3 times, as channels U_AMC_Box_Mainboard/U_QSFP0, U_AMC_Box_Mainboard/U_QSFP1, U_AMC_Box_Mainboard/U_QSFP2. Parts and nets are listed once, with the designators drawn on the sheet.
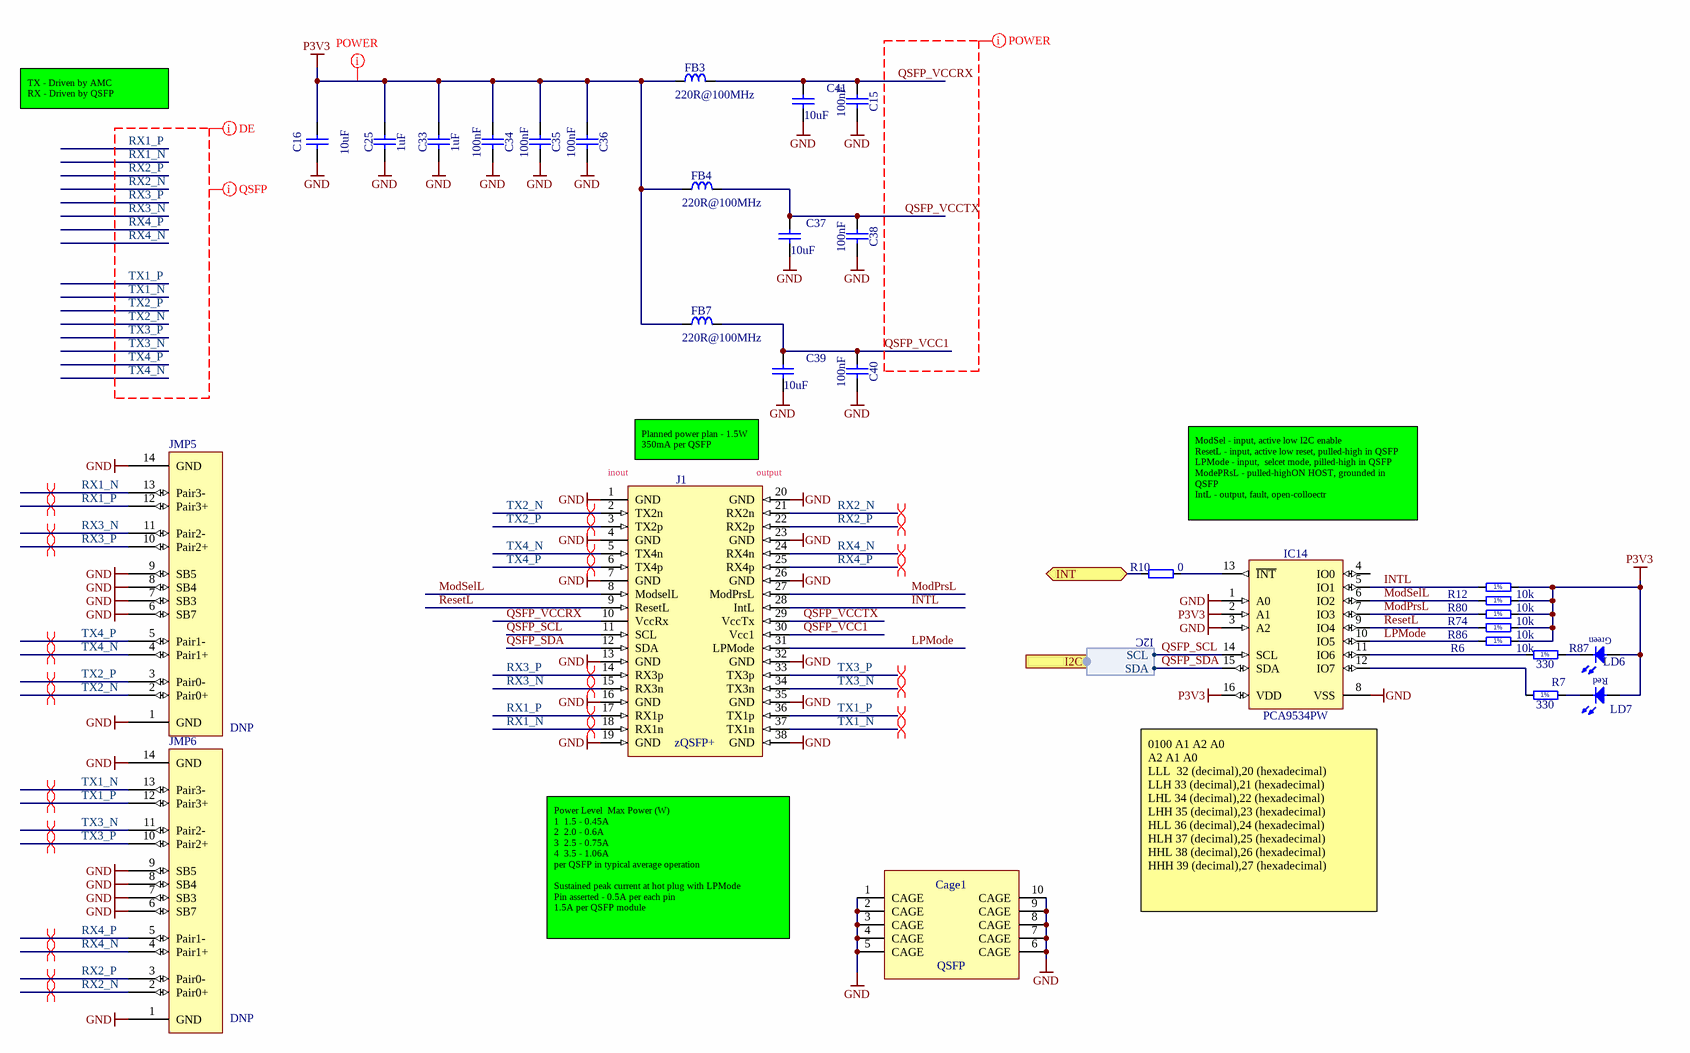
[diagram p16: QSFP.SchDoc]

### Parts
C15  100nF  [CAPC0603X33N]
C16  10uF  [CAPC2012X135N]
C25  1uF  [CAPC1608X87N]
C33  1uF  [CAPC1608X87N]
C34  100nF  [CAPC0603X33N]
C35  100nF  [CAPC0603X33N]
C36  100nF  [CAPC0603X33N]
C37  10uF  [CAPC2012X135N]
C38  100nF  [CAPC0603X33N]
C39  10uF  [CAPC2012X135N]
C40  100nF  [CAPC0603X33N]
C41  10uF  [CAPC2012X135N]
Cage1  QSFP  [TYCO_2170703-7]
FB3  220R@100MHz  [INDC2012X105N]
FB4  220R@100MHz  [INDC2012X105N]
FB7  220R@100MHz  [INDC2012X105N]
IC14  PCA9534PW  [SOP65P640X110-16N]
J1  zQSFP+  [TYCO_1551920-2]
JMP5  DNP  [3M_Twinax_SL8801/12-10DA5-00]
JMP6  DNP  [3M_Twinax_SL8801/12-10DA5-00]
LD6  LED_AVAGO_HSME-C120  [LED_AVAGO_HSME-C120]  (value not drawn)
LD7  Red  [LED_AVAGO_HSME-C120rev]  (value not drawn)
R6  10k  [RESC1005X40N]
R7  330  [RESC1608X55N]
R10  0  [RESC1005X40N]
R12  10k  [RESC1005X40N]
R74  10k  [RESC1005X40N]
R80  10k  [RESC1005X40N]
R86  10k  [RESC1005X40N]
R87  330  [RESC1608X55N]

### Ports
I2C (harness I2C), INT (bidir)

### Harnesses
I2C: SCL, SDA

### Nets
GND: C15.2 C16.2 C25.1 C33.1 C34.2 C35.2 C36.2 C37.2 C38.2 C39.2 C40.2 C41.2 Cage1.1(CAGE) Cage1.2(CAGE) Cage1.3(CAGE) Cage1.4(CAGE) Cage1.5(CAGE) Cage1.6(CAGE) Cage1.7(CAGE) Cage1.8(CAGE) Cage1.9(CAGE) Cage1.10(CAGE) IC14.1(A0) IC14.3(A2) IC14.8(VSS) J1.1(GND) J1.4(GND) J1.7(GND) J1.13(GND) J1.16(GND) J1.19(GND) J1.20(GND) J1.23(GND) J1.26(GND) J1.32(GND) J1.35(GND) J1.38(GND) JMP5.1(GND) JMP5.6(SB7) JMP5.7(SB3) JMP5.8(SB4) JMP5.9(SB5) JMP5.14(GND) JMP6.1(GND) JMP6.6(SB7) JMP6.7(SB3) JMP6.8(SB4) JMP6.9(SB5) JMP6.14(GND)
P3V3: C16.1 C25.2 C33.2 C34.1 C35.1 C36.1 FB3.1 FB4.1 FB7.1 IC14.2(A1) IC14.16(VDD) LD6.2(A) LD7.1(A) R6.2 R12.2 R74.2 R80.2 R86.2
INT: R10.1 ; port INT
INTL: IC14.5(IO1) J1.28(IntL) R12.1
LPMode: IC14.10(IO5) J1.31(LPMode) R6.1
ModPrsL: IC14.7(IO3) J1.27(ModPrsL) R74.1
ModSelL: IC14.6(IO2) J1.8(ModselL) R80.1
QSFP_SCL: IC14.14(SCL) J1.11(SCL) ; port I2C.SCL
QSFP_SDA: IC14.15(SDA) J1.12(SDA) ; port I2C.SDA
QSFP_VCC1: C39.1 C40.1 FB7.2 J1.30(Vcc1)
QSFP_VCCRX: C15.1 C41.1 FB3.2 J1.10(VccRx)
QSFP_VCCTX: C37.1 C38.1 FB4.2 J1.29(VccTx)
ResetL: IC14.9(IO4) J1.9(ResetL) R86.1
RX1_N: J1.18(RX1n) JMP5.13(Pair3-)
RX1_P: J1.17(RX1p) JMP5.12(Pair3+)
RX2_N: J1.21(RX2n) JMP6.2(Pair0+)
RX2_P: J1.22(RX2p) JMP6.3(Pair0-)
RX3_N: J1.15(RX3n) JMP5.11(Pair2-)
RX3_P: J1.14(RX3p) JMP5.10(Pair2+)
RX4_N: J1.24(RX4n) JMP6.4(Pair1+)
RX4_P: J1.25(RX4p) JMP6.5(Pair1-)
TX1_N: J1.37(TX1n) JMP6.13(Pair3-)
TX1_P: J1.36(TX1p) JMP6.12(Pair3+)
TX2_N: J1.2(TX2n) JMP5.2(Pair0+)
TX2_P: J1.3(TX2p) JMP5.3(Pair0-)
TX3_N: J1.34(TX3n) JMP6.11(Pair2-)
TX3_P: J1.33(TX3p) JMP6.10(Pair2+)
TX4_N: J1.5(TX4n) JMP5.4(Pair1+)
TX4_P: J1.6(TX4p) JMP5.5(Pair1-)
NetIC14_11: IC14.11(IO6) R87.1
NetIC14_12: IC14.12(IO7) R7.1
NetIC14_13: IC14.13(~{INT}) R10.2
NetLD6_1: LD6.1(C) R87.2
NetLD7_2: LD7.2(C) R7.2

Not connected (* = marked no-connect by the designer): IC14 4(IO0)

### Channels
U_AMC_Box_Mainboard/U_QSFP0: designators end in _U_QSFP0; ports INT=NetIC20_0
U_AMC_Box_Mainboard/U_QSFP1: designators end in _U_QSFP1; ports INT=NetIC20_0
U_AMC_Box_Mainboard/U_QSFP2: designators end in _U_QSFP2; ports INT=NetIC20_0

### Layout directives
differential pair: RX1_N_U_QSFP0, RX1_P_U_QSFP0, RX2_N_U_QSFP0, RX2_P_U_QSFP0, RX3_N_U_QSFP0, RX3_P_U_QSFP0, RX4_N_U_QSFP0, RX4_P_U_QSFP0, TX1_N_U_QSFP0, TX1_P_U_QSFP0, TX2_N_U_QSFP0, TX2_P_U_QSFP0, TX3_N_U_QSFP0, TX3_P_U_QSFP0, TX4_N_U_QSFP0, TX4_P_U_QSFP0
net class POWER: P3V3, QSFP_VCC1, QSFP_VCCRX, QSFP_VCCTX
net class QSFP: RX1_N, RX1_P, RX2_N, RX2_P, RX3_N, RX3_P, RX4_N, RX4_P, TX1_N, TX1_P, TX2_N, TX2_P, TX3_N, TX3_P, TX4_N, TX4_P
net class DE: RX1_N, RX1_P, RX2_N, RX2_P, RX3_N, RX3_P, RX4_N, RX4_P, TX1_N, TX1_P, TX2_N, TX2_P, TX3_N, TX3_P, TX4_N, TX4_P

### Notes on the sheet
- TX - Driven by AMC
  RX - Driven by QSFP
- (near J1) inout
- Planned power plan - 1.5W
  350mA per QSFP
- (near J1) output
- ModSel - input, active low I2C enable
  ResetL - input, active low reset, pulled-high in QSFP
  LPMode - input,  selcet mode, pilled-high in QSFP
  ModePRsL - pulled-highON HOST, grounded in QSFP
  IntL - output, fault, open-colloectr
- (near IC14) 0100 A1 A2 A0
  A2 A1 A0
  LLL 	32 (decimal),20 (hexadecimal)
  LLH	33 (decimal),21 (hexadecimal)
  LHL	34 (decimal),22 (hexadecimal)
  LHH	35 (decimal),23 (hexadecimal)
  HLL	36 (decimal),24 (hexadecimal)
  HLH	37 (decimal),25 (hexadecimal)
  HHL	38 (decimal),26 (hexadecimal)
  HHH	39 (decimal),27 (hexadecimal)
- Power Level  Max Power (W)
  1  1.5 - 0.45A
  2  2.0 - 0.6A
  3  2.5 - 0.75A
  4  3.5 - 1.06A
  per QSFP in typical average operation
  Sustained peak current at hot plug with LPMode
  Pin asserted - 0.5A per each pin
  1.5A per QSFP module
- Project/Equipment
- Document
- Designer
- Drawn by
- Check.by
- Copyright WUT ISE 2020.
  This documentation describes Open Hardware and is licensed under the CERN OHL v.1.2. You may redistribute and modify this documentation under the terms of the CERN OHL v.1.2. (http://ohwr.org/CERNOHL). This documentation is distributed WITHOUT ANY EXPRESS OR IMPLIED WARRANTY, INCLUDING OF MERCHANTABILITY, SATISFACTORY QUALITY AND FITNESS FOR A PARTICULAR PURPOSE. Please see the CERN OHL v.1.2 for applicable conditions.
- Contact
- File
- Last Mod.
- Print Date
- Sheet
- Size
- A3
- of
- Rev
- (in symbol R0402_10K_1%_0.0625W_100PPM) 1%
- (in symbol R0603_330R_1%_0.1W_100PPM) 1%

### Library data of the parts
C15 C34-C36 C38 C40 = CC0201_100NF_6.3V_10%_X5R: Non-polarised capacitor; Part Description: SMD Multilayer Chip Ceramic Capacitor; Manufacturer: GENERIC; Manufacturer1 Part Number: 02016D104KAT2A; Voltage: 6.3V; TC: X5R; Tolerance: ±10%; Table: Capacitors SMD; Part Number: CC0201_100NF_6.3V_10%_X5R; Component Kind: Standard; Component Type: Standard; Pin Count: 2; Value: 100nF; Status: Not Recommended; Manufacturer Part Number: CC0201_100NF_6.3V_10%_X5R; Case: 0201; Mounted: Yes; Socket: No; SMD: Yes; Manufacturer1 Example: AVX; Manufacturer1 ComponentHeight: 0.33mm; HelpURL: \\cern.ch\dfs\Applications\Altium\Datasheets\CC0201_X5R_AVX.pdf; Author: CERN DEM JLC; CreateDate: 2007-12-03; LatestRevisionDate: 2007-12-03
C16 C37 C39 C41 = CC0805_10UF_10V_10%_X7R: as C43 on sheet CPU_ETH; Part Number: CC0805_10UF_10V_10%_X7R; Component Kind: Standard; Component Type: Standard; Pin Count: 2; Value: 10uF; Status: Preferred; Manufacturer Part Number: CC0805_10UF_10V_10%_X7R; Case: 0805; Mounted: Yes; Socket: No; SMD: Yes; Manufacturer1 Example: MURATA; Manufacturer1 ComponentHeight: 1.35mm; HelpURL: \\cern.ch\dfs\Applications\Altium\Datasheets\CC0805_X7R_MURATA.pdf; Author: CERN DEM JLC; CreateDate: 2012-04-30; LatestRevisionDate: 2012-04-30
C25 C33 = CC0603_1UF_25V_10%_X7R: as C2#1 on sheet USB_I2C_Bridge; Part Number: CC0603_1UF_25V_10%_X7R; Component Kind: Standard; Component Type: Standard; Pin Count: 2; Value: 1uF; Status: None; Manufacturer Part Number: CC0603_1UF_25V_10%_X7R; Case: 0603; Mounted: Yes; Socket: No; SMD: Yes; Manufacturer1 Example: MURATA; Manufacturer1 ComponentHeight: 0.9mm; HelpURL: \\cern.ch\dfs\Applications\Altium\Datasheets\CC0603_X7R_MURATA.pdf; Author: CERN DEM JLC; CreateDate: 2011-01-18; LatestRevisionDate: 2011-01-18
Cage1 = TYCO_2170703-7: QSFP 1x1 Cage (10Pins); Part Description: 1x1 Through Bezel Cage with EMI Spring Finger For Use with QSFP Connector (Quad Small Form-factor Pluggable); Manufacturer: TYCO ELECTRONICS; Part Number: TYCO_2170703-7; Component Kind: Standard; Component Type: Standard; Pin Count: 10; Family: QSFP; Mounted: Yes; Socket: No; SMD: No; PressFit: Yes; Sense: No; Status: None; Manufacturer Part Number: 2170703-7; ComponentHeight: 9.7mm; HelpURL: \\cern.ch\dfs\Applications\Altium\Datasheets\TYCO_2170703-7.pdf; Author: CERN DEM HF; CreateDate: 11.02.2022; LatestRevisionDate: 11.02.2022
FB3 FB4 FB7 = IND0805_MURATA_BLM21PG221SN1D: as FB1 on sheet USB_Hub_AMCbox; Part Number: IND0805_MURATA_BLM21PG221SN1D; Component Kind: Standard; Component Type: Standard; Pin Count: 2; Value: 220R@100MHz; Status: None; Manufacturer Part Number: BLM21PG221SN1D; Case: 0805; Mounted: Yes; Socket: No; SMD: Yes; ComponentHeight: 1.05mm; HelpURL: \\cern.ch\dfs\Applications\Altium\Datasheets\IND0402_MURATA_BLM21P.pdf; Author: CERN DEM JLC; CreateDate: 2010-01-25; LatestRevisionDate: 2010-01-25
IC14 = PCA9534PW: 8-Bit I2C-Bus and SMBus Low Power I/O Port with Interrupt; Manufacturer: ANALOG DEVICES; PressFit: No; Bonding: No; Table: Analog & Interface; Part Number: PCA9534PW; Component Kind: Standard; Component Type: Standard; Device: PCA9534PW; PackageDescription: SOP, 0.65mm pitch; 16 pin, 4.40mm W X 5.00mm L X 1.10mm H body IPC Medium Density; Part Description: 8-Bit I2C-Bus and SMBus Low Power I/O Port with Interrupt; Manufacturer Part Number: PCA9534PW; Pin Count: 16; Case: SSOP16; Mounted: Yes; Socket: No; SMD: Yes; ComponentHeight: 1.1mm; Author: CERN DEM JLC; HelpURL: \\cern.ch\dfs\Applications\Altium\Datasheets\PCA9534PW.pdf; CreateDate: 2013-12-18; LatestRevisionDate: 2013-12-18
J1 = TYCO_1551920-2: 38Position QSFP Connector  (Quad Small Form-factor Pluggable); Part Description: 38 Positions, Pitch 0.8mm zSFP+ Receptacle (Small Form-factor Pluggable); Manufacturer: TYCO ELECTRONICS; PressFit: No; Part Number: TYCO_1551920-2; Component Kind: Standard; Component Type: Standard; Pin Count: 38; Family: zQSFP+; Mounted: Yes; Socket: No; SMD: No; Sense: No; Status: None; Manufacturer Part Number: 1551920-2; ComponentHeight: 6.1mm; HelpURL: \\cern.ch\dfs\Applications\Altium\Datasheets\TYCO_1551920-2.pdf; Author: CERN DEM JLC; CreateDate: 24.05.2018; LatestRevisionDate: 24.05.2018
JMP5 JMP6 = CBL_TWINAX_3M_4pairs_SB: Flat Ribbon Cable Silver 8 (4 Pair) Conductors 0.093" (2.37mm) Between Pairs Flat Twin Axial 500.0' (152.40m)
LD6 = LED_AVAGO_HSME-C120: as LD2 on sheet CPU_ETH; Part Number: LED_AVAGO_HSME-C120; Component Kind: Standard; Component Type: Standard; Color: Green; PackageDescription: Green Chip LED, 2-Leads, Body 1.7x1.1mm, Side Emitting Package; Manufacturer Part Number: HSME-C120; Pin Count: 2; Mounted: Yes; Socket: No; SMD: Yes; ComponentHeight: 0.7mm; HelpURL: \\cern.ch\dfs\Applications\Altium\Datasheets\LED_AVAGO_HSME-C120.pdf; ComponentLink1URL: \\cern.ch\dfs\Applications\Altium\Datasheets\LED_AVAGO_HSME-C110_DESIGN-GUIDE.pdf; ComponentLink1Description: Design Guide; Author: CERN DEM JMW; CreateDate: 2009-07-22; LatestRevisionDate: 2012-06-20
LD7 = LED_SMD_90deg_mini_R: LED Red Avago C120; Part Number: LED_AVAGO_HSMC-C120; Part Description: High Performance Right Angle Chip Red LED; Manufacturer: AVAGO TECHNOLOGIES; Manufacturer Part Number: HSMC-C120; Table: LEDs & Displays; Component Kind: Standard; Component Type: Standard; Color: Red; Footprint: LED_AVAGO_HSMC-C120; PackageDescription: Red Chip LED, 2-Leads, Body 1.7x1.1mm, Side Emitting Package; Pin Count: 2; Mounted: Yes; Socket: No; SMD: Yes; ComponentHeight: 0.7mm; HelpURL: \\cern.ch\dfs\Applications\Altium\Datasheets\LED_AVAGO_HSME-C120.pdf; ComponentLink1URL: \\cern.ch\dfs\Applications\Altium\Datasheets\LED_AVAGO_HSME-C110_DESIGN-GUIDE.pdf; ComponentLink1Description: Design Guide; Author: CERN DEM JMW; CreateDate: 2009-07-22; LatestRevisionDate: 2012-06-20
R6 R12 R74 R80 R86 = R0402_10K_1%_0.0625W_100PPM: as R147-R150 on sheet Thermal_MGT; Part Number: R0402_10K_1%_0.0625W_100PPM; Component Kind: Standard; Component Type: Standard; Pin Count: 2; Value: 10k; Status: Not recommended; Power: 0.0625W; Tolerance: ±1%; Manufacturer Part Number: R0402_10K_1%_0.0625W_100PPM; Case: 0402; Mounted: Yes; Socket: No; SMD: Yes; Manufacturer1 Example: YAGEO PHYCOMP; Manufacturer1 ComponentHeight: 0.4mm; HelpURL: \\cern.ch\dfs\Applications\Altium\Datasheets\R0402_Phycomp_RC0402.pdf; Author: CERN DEM JLC; CreateDate: 2007-12-03; LatestRevisionDate: 2012-10-17
R7 R87 = R0603_330R_1%_0.1W_100PPM: as R56 on sheet CPU_ETH; Part Number: R0603_330R_1%_0.1W_100PPM; Component Kind: Standard; Component Type: Standard; Pin Count: 2; Value: 330; Status: Preferred; Tolerance: ±1%; Manufacturer Part Number: R0603_330R_1%_0.1W_100PPM; Case: 0603; Mounted: Yes; Socket: No; SMD: Yes; Manufacturer1 Example: NIC COMPONENT; Manufacturer1 ComponentHeight: 0.55mm; HelpURL: \\cern.ch\dfs\Applications\Altium\Datasheets\R0603_NIC_NRC.pdf; Author: CERN DEM JLC; CreateDate: 2007-12-03; LatestRevisionDate: 2008-03-13
R10 = R0402_0R_JUMPER: Resistor; Part Description: 1A (0.05R Max DC Resistance) Zero Ohm Jumper; Manufacturer: GENERIC; Manufacturer1 Part Number: 232270591001L; Table: Resistors SMD; Part Number: R0402_0R_JUMPER; Component Kind: Standard; Component Type: Standard; Pin Count: 2; Value: 0; Status: Not recommended; Manufacturer Part Number: R0402_0R_JUMPER; Case: 0402; Mounted: Yes; Socket: No; SMD: Yes; Manufacturer1 Example: YAGEO PHYCOMP; Manufacturer1 ComponentHeight: 0.4mm; HelpURL: \\cern.ch\dfs\Applications\Altium\Datasheets\R0402_Phycomp_RC0402.pdf; Author: CERN DEM JLC; CreateDate: 2007-12-03; LatestRevisionDate: 2012-10-17